# EasyEDA Pro project LED伏安特性实验仪.eprj, board 恒流源模块
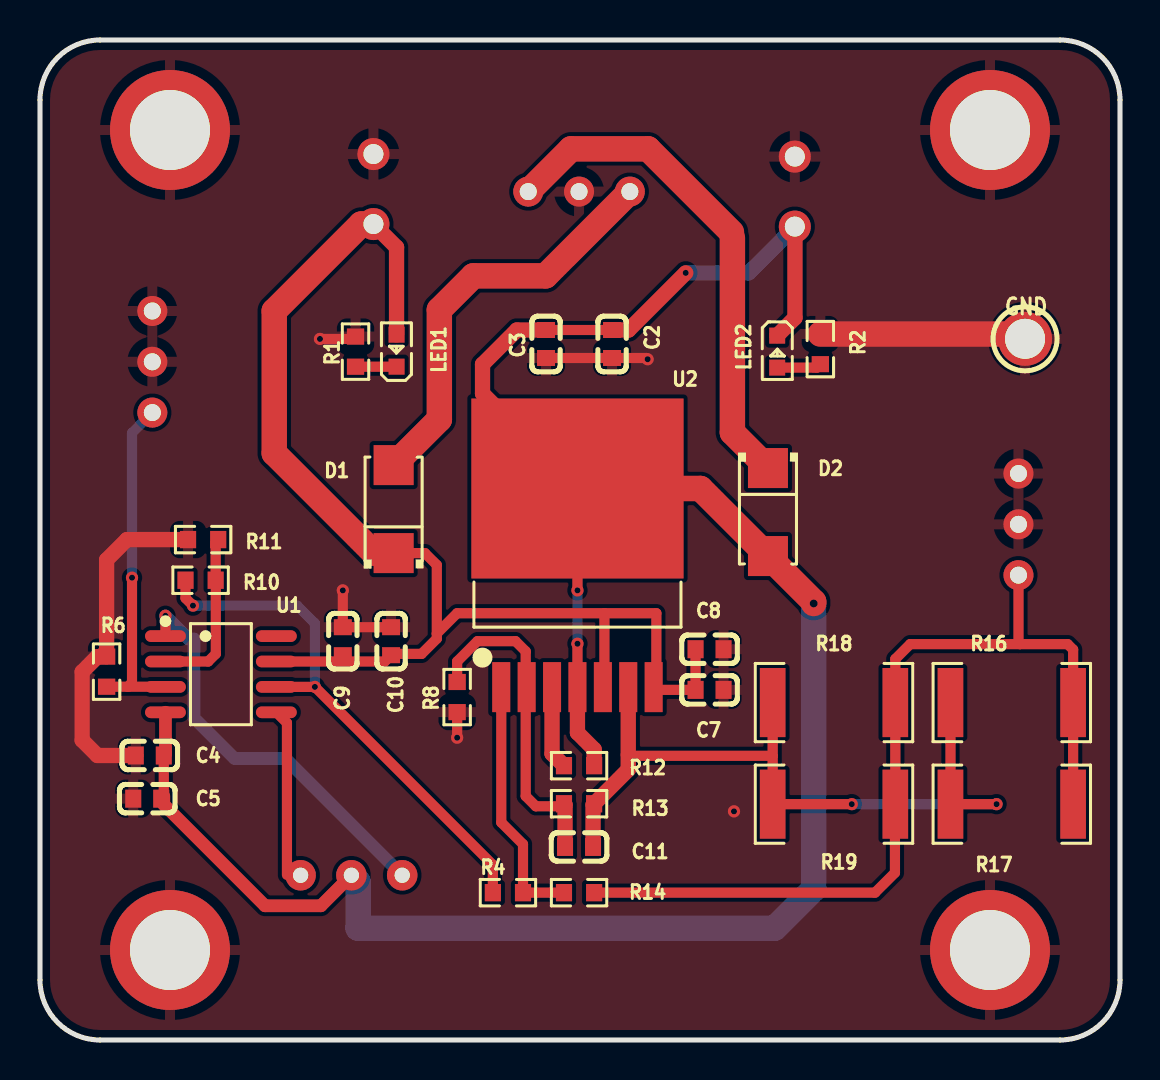
[diagram p9: board, top side]
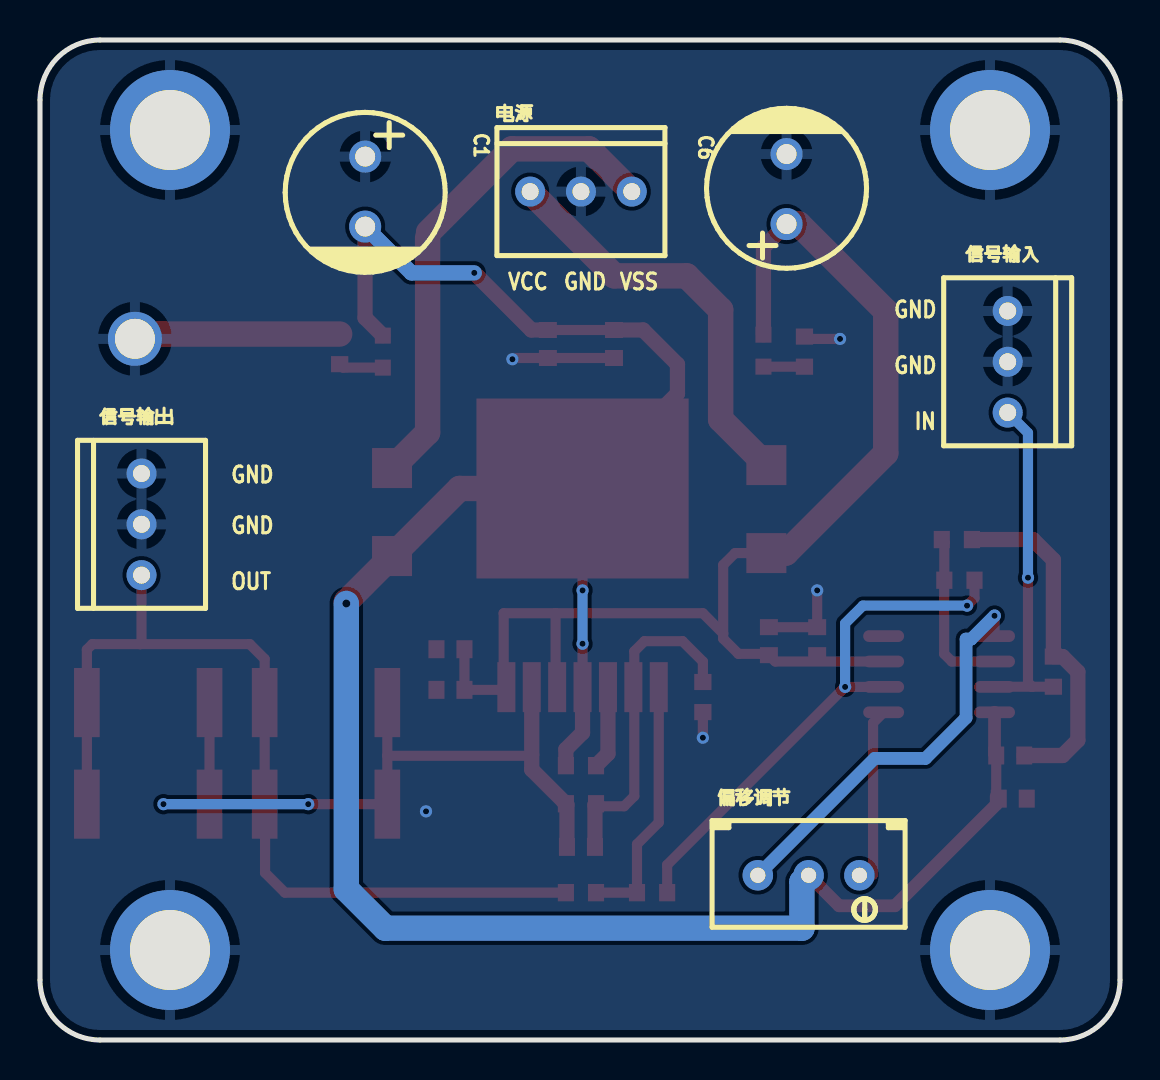
[diagram p10: board, bottom side, seen from below]

Outline 54 x 50 mm; copper layers: Top Layer, Bottom Layer. Coordinates in mm from the lower left corner of the outline.
Outline path: 0,47 0,3 arc(0.88,0.88) 3,0 51,0 arc(53.12,0.88) 54,3 54,47 arc(53.12,49.12) 51,50 3,50 arc(0.88,49.12) 0,47
Stack: Top Layer 0.035mm / Dielectric1 1.51mm FR4 er 4.5 / Bottom Layer 0.035mm

## Design rules (mm)
template: 自定义配置
spacing copperThickness1oz (default): track to track 0.102, other pairs 0.152 to 0.3
spacing copperThickness2oz: track to track 0.203, other pairs 0.152 to 0.3
track width copperThickness1oz (default): min 0.127, default 0.254, max 2.54
track width copperThickness2oz: min 0.203, default 0.254, max 2.54
differential pair differentialPair (default): width min 0.127, default 0.254, max 2.54; gap min 0.152, default 0.152
via viaSize (default): diameter min 0.5, default 0.61, max 10; hole min 0.3, default 0.305, max 6.3

## Placement (name value [footprint] x y rotation side)
C1  470uF  [cap-th_bd8.0-p3.50-d0.6-fd_1]  37.74 42.42 270 bottom
C2  100nF  [C0603]  28.6 34.8 90 top
C3  10uF  [C0603]  25.3 34.8 90 top
C4  100nF  [C0603]  5.49 14.23 0 top
C5  10uF  [C0603]  5.36 12.07 0 top
C6  470uF  [cap-th_bd8.0-p3.50-d0.6-fd_1]  16.67 42.55 90 bottom
C7  100nF  [C0603]  33.48 17.51 0 top
C8  10uF  [C0603]  33.48 19.54 0 top
C9  100nF  [C0603]  15.14 19.94 90 top
C10  10uF  [C0603]  17.55 19.94 90 top
C11  5pF  [C0603]  26.95 9.65 0 top
D1  SS34  [SMA_L4.3-W2.6-LS5.2-RD]  17.68 26.55 90 top
D2  SS34  [SMA_L4.3-W2.6-LS5.2-RD]  36.4 26.4 270 top
LED1  KT-0603R  [LED0603-RD]  17.83 34.47 90 top
LED2  KT-0603R  [LED0603-RD]  36.86 34.42 270 top
NOREF  -  [Pad_e206]  6.5 4.5 0 top
NOREF#2  -  [Pad_e330]  47.5 45.5 0 top
NOREF#3  -  [Pad_e105]  6.5 45.5 0 top
NOREF#4  -  [Pad_e331]  47.5 4.5 0 top
R1  5.1kΩ  [R0603]  15.78 34.42 270 top
R2  5.1kΩ  [R0603]  39.02 34.55 270 top
R4  100kΩ  [R0603]  23.4 7.37 0 top
R6  3.6MΩ  [R0603]  3.33 18.42 270 top
R8  100kΩ  [R0603]  20.86 17.15 90 top
R10  1kΩ  [R0603]  8.03 22.99 180 top
R11  NC  [R0603]  8.16 25.02 0 top
R12  12kΩ  [R0603]  26.95 13.72 0 top
R13  100kΩ  [R0603]  26.95 11.81 0 top
R14  100kΩ  [R0603]  26.95 7.37 0 top
R16  24Ω  [R2512]  48.59 16.87 0 top
R17  24Ω  [R2512]  48.59 11.79 0 top
R18  24Ω  [R2512]  39.7 16.87 0 top
R19  24Ω  [R2512]  39.7 11.79 0 top
U1  OPA445AU/2K5  [SOIC-8_L4.9-W3.9-P1.27-LS6.0-BL]  9.05 18.29 270 top
U2  OPA547FKTWT  [DDPAK-7_L10.2-W8.9-P1.27-LS14.0-BR]  26.87 22.61 270 top
U3  TP-黄色测试点  [TESTPOINT-TH_BD3.2]  49.25 35.06 0 top
信号输入  -  [CH2.54-3插座]  5.62 33.91 270 bottom
信号输出  -  [CH2.54-3插座]  48.92 25.78 90 bottom
偏移调节  1KΩ  [RES-ADJ-TH_3296W]  15.57 8.24 270 bottom
电源  -  [CH2.54-3插座]  26.95 42.42 180 bottom

## Footprints (pads in the part's own frame, mm; a bottom-side part is the same pattern mirrored in y, then rotated)
C0603
  rect 0.8x0.9 smd: 1(-0.7,0) 2(0.7,0)
cap-th_bd8.0-p3.50-d0.6-fd_1
  round 1.6 hole 1: 1(-1.75,0) 2(1.75,0)
CH2.54-3插座
  round 1.5 hole 0.85: 1(-2.54,0) 2(0,0) 3(2.54,0)
DDPAK-7_L10.2-W8.9-P1.27-LS14.0-BR
  rect 2.5x0.9 smd: 1(4.966,-3.81) 2(4.966,-2.54) 3(4.966,-1.27) 4(4.966,0) 5(4.966,1.27) 6(4.966,2.54) 7(4.966,3.81)
  rect 9x10.608 smd: 8(-4.966,0)
LED0603-RD
  rect 0.8x0.8 smd: 1(-0.799,0) 2(0.799,0)
Pad_e105
  round 6 hole 4: 1(0,0)
Pad_e206
  round 6 hole 4: 1(0,0)
Pad_e330
  round 6 hole 4: 1(0,0)
Pad_e331
  round 6 hole 4: 1(0,0)
R0603
  rect 0.806x0.864 smd: 1(-0.753,0) 2(0.753,0)
R2512
  rect 1.282x3.456 smd: 1(-3.067,0) 2(3.067,0)
RES-ADJ-TH_3296W
  round 1.524 hole 0.762: 1(0,2.54) 2(0,0) 3(0,-2.54)
SMA_L4.3-W2.6-LS5.2-RD
  rect 2x2 smd: 1(-2.2,0) 2(2.2,0)
SOIC-8_L4.9-W3.9-P1.27-LS6.0-BL
  oval 0.588x2.045 smd: 1(-1.905,-2.772) 2(-0.635,-2.772) 3(0.635,-2.772) 4(1.905,-2.772) 5(1.905,2.772) 6(0.635,2.772) 7(-0.635,2.772) 8(-1.905,2.772)
TESTPOINT-TH_BD3.2
  round 2.7 hole 2: 1(0,0)

## Nets
GND: C1.1 C2.1 C3.1 C4.1 C5.1 C6.2 C7.2 C8.2 C9.2 C10.2 NOREF.1 NOREF#2.1 NOREF#3.1 NOREF#4.1 R1.1 R2.1 R6.1 R8.1 R11.1 U3.1 信号输入.1 信号输入.2 信号输出.2 信号输出.3 电源.2
VCC: C6.1 C7.1 C8.1 C9.1 C10.1 D1.1 LED1.2 U1.7 U2.5 U2.7
VCC_IN: D1.2 电源.1
VSS: C1.2 C2.2 C3.2 C4.2 C5.2 D2.2 LED2.1 R12.2 U1.4 U2.4 U2.8 偏移调节.2
VSS_IN: D2.1 电源.3
$1N1624: R10.1 R11.2 U1.2
$1N1626: U1.1 偏移调节.3
$1N1627: U1.5 偏移调节.1
$1N1631: R4.1 R10.2 U1.6
$1N1633: C11.1 R8.2 R13.1 U2.2
$1N1634: C11.2 R13.2 R16.1 R17.1 R18.1 R19.1 U2.6
$1N1636: R4.2 R14.1 U2.1
$1N1639: R12.1 U2.3
$1N1642: R14.2 R16.2 R17.2 R18.2 R19.2 信号输出.1
$1N1651: R6.2 U1.3 信号输入.3
$1N1652: LED1.1 R1.2
$1N1653: LED2.2 R2.2

Pads without a net: U1 8

## Via types
v1: diameter 0.61, hole 0.305, Top Layer to Bottom Layer, 14 vias
v2: diameter 0.8, hole 0.4, Top Layer to Bottom Layer, 1 via

## Routing (per net, layer and track width the routed paths; a pad name or vN(x,y) marks a point on that pad's centre or on a via; arc(x,y) is an arc through that point)
GND: length 40.1
  Top Layer w0.508: v1(20.86,15.11) R8.1 ; C10.2 C9.2 v1(15.14,22.48) ; C3.1 C2.1 30.32,34.1 v1(30.38,34.04) ; v1(14,35.05) 15.66,35.05 R1.1
  Top Layer w0.762: C4.1 2.87,14.23 2.11,14.99 2.11,18.41 2.87,19.17 R6.1 3.33,24 4.35,25.02 R11.1
  Top Layer w1.27: R2.1 49.01,35.3 U3.1
  vias: v1(34.7,11.43)
VCC: length 65.6
  Top Layer w0.508: 28.22,21.34 20.85,21.34 19.84,20.32 ; 28.22,21.34 30.82,21.34 30.82,17.78 U2.7 30.82,17.51 32.78,17.51 32.78,19.54 ; 28.22,21.34 28.22,17.72 U2.5 ; 19.84,20.32 19.84,23.75 19.25,24.34 18.08,24.34 ; 19.84,20.32 19.84,20.07 19.08,19.31 17.62,19.31 C10.1 17.24,18.92 11.82,18.92
  Top Layer w0.762: 16.67,40.8 17.83,39.64 LED1.2
  Top Layer w1.27: 18.08,24.34 D1.1 16.71,24.34 11.71,29.34 11.71,36.45 16.06,40.8 16.67,40.8
VCC_IN: length 20.7
  Top Layer w1.27: D1.2 19.97,31.03 19.97,36.51 21.67,38.21 25.28,38.21 电源.1
VSS: length 118.5
  Top Layer w0.508: v1(26.87,22.48) 26.87,27.58 ; C3.2 C2.2 ; C5.2 6.19,12.19 C4.2 ; U2.4 v1(26.87,19.81)
  Top Layer w0.635: 偏移调节.2 14.05,6.71 11.25,6.71 6.19,11.77 6.19,12.19 ; U1.4 6.27,14.31 C4.2
  Top Layer w0.762: 26.87,27.58 22.13,32.32 22.13,33.78 23.84,35.5 C3.2 ; R12.2 27.71,14.53 26.87,15.36 U2.4 ; 37.75,40.67 37.75,36.11 LED2.1 ; v1(32.29,38.36) 29.43,35.5 C2.2
  Top Layer w1.27: v2(38.68,21.83) 38.68,21.91 D2.2 33.02,27.58 26.87,27.58
  Bottom Layer w0.508: v1(26.87,19.81) v1(26.87,22.48)
  Bottom Layer w0.762: 37.75,40.67 35.43,38.36 v1(32.29,38.36)
  Bottom Layer w1.27: 偏移调节.2 15.9,7.9 15.9,5.59 36.73,5.59 38.68,7.54 v2(38.68,21.83)
VSS_IN: length 25
  Top Layer w1.27: 34.57,40.39 30.4,44.56 26.55,44.56 电源.3 ; 34.62,40.11 34.62,30.38 36.4,28.6
$1N1624: length 8.4
  Top Layer w0.508: R11.2 8.78,24.89 R10.1 8.79,22.98 8.79,19.31 8.41,18.92 6.27,18.92
$1N1626: length 20.5
  Top Layer w0.508: U1.1 v1(6.27,21.21)
  Bottom Layer w0.635: v1(6.27,21.21) 7.44,20.05 7.7,20.05 7.7,16.11 9.73,14.08 12.27,14.08 偏移调节.3
$1N1627: length 8.3
  Top Layer w0.508: 12.35,8.26 12.35,15.86 U1.5
$1N1631: length 27
  Top Layer w0.508: v1(7.65,21.72) 7.28,22.09 R10.2 ; R4.1 22.64,8.76 v1(13.74,17.66) U1.6
  Bottom Layer w0.508: v1(7.65,21.72) 12.86,21.72 13.74,20.83 v1(13.74,17.66)
$1N1633: length 16.7
  Top Layer w0.508: 24.29,17.69 24.29,12.19 24.79,11.69 26.07,11.69 26.2,11.81 ; 24.29,17.69 U2.2 ; 24.29,17.69 24.29,19.43 23.78,19.94 21.87,19.94 20.86,18.92 R8.2
  Top Layer w0.762: C11.1 26.25,11.76 26.2,11.81
$1N1634: length 39.6
  Top Layer w0.508: 36.63,14.21 29.47,14.21 29.41,14.26 ; 36.63,14.21 R19.1 v1(40.59,11.79) ; 36.63,14.21 R18.1 ; v1(47.83,11.79) R17.1 R16.1
  Top Layer w0.762: C11.2 27.65,11.76 R13.2 29.41,13.52 U2.6
  Bottom Layer w0.508: v1(40.59,11.79) v1(47.83,11.79)
$1N1636: length 12.8
  Top Layer w0.508: 26.2,7.37 R4.2 24.15,9.79 23.06,10.88 U2.1
$1N1639: length 4.2
  Top Layer w0.762: 26.2,13.72 25.6,14.31 25.6,17.64
$1N1642: length 46.7
  Top Layer w0.508: R17.2 R16.2 51.66,19.52 51.38,19.79 48.99,19.79 ; R14.2 41.75,7.37 42.75,8.36 42.75,11.77 R19.2 R18.2 42.77,19.05 43.51,19.79 48.99,19.79 ; 48.99,19.79 48.92,19.86 信号输出.1
$1N1651: length 17.2
  Top Layer w0.508: U1.3 6.26,17.66 4.39,17.66 ; R6.2 4.39,17.66 ; 4.39,17.66 4.6,17.87 v1(4.6,23.12)
  Bottom Layer w0.508: 信号输入.3 4.6,30.36 v1(4.6,23.12)
$1N1652: length 2
  Top Layer w0.508: R1.2 17.83,33.67
$1N1653: length 2.2
  Top Layer w0.508: LED2.2 38.84,33.62 R2.2

## Copper pours and planes (outline as drawn; the poured copper is in the pictures)
GND on Top Layer: -10.89,55.25 60.61,55.25 60.61,-12.44 -10.89,-12.44
GND on Bottom Layer: -6.53,53.96 57.1,53.96 57.1,-9.29 -6.53,-9.29

## Text on the board
Bottom Silkscreen Layer: IN | GND | VSS | VCC | OUT
Top Silkscreen Layer: GND
